# Altium schematic sheet Supply_BuckVout.SchDoc: Power Supply
size 420 x 297 mm; EDA_Number: ARTIQ; Projet: HVPSU_ISOL; Author: G.Kasprowicz; CompanyName: WUT ISE; DrawnBy: G.Kasprowicz; Organization: WUT ISE; Address1: PW ISE; Address2: Nowowiejska 15/19 00-665 Warsaw; Address3: gkasprow@gmail.com; DocumentNumber: 4; Revision: 2; SheetNumber: 4; SheetTotal: 7; ModifiedBy: -; CheckedDate: -; DivGrp: WUT ISE; Designer: G.Kasprowicz; ModifiedDate: -; ProjectName: Sensor Box
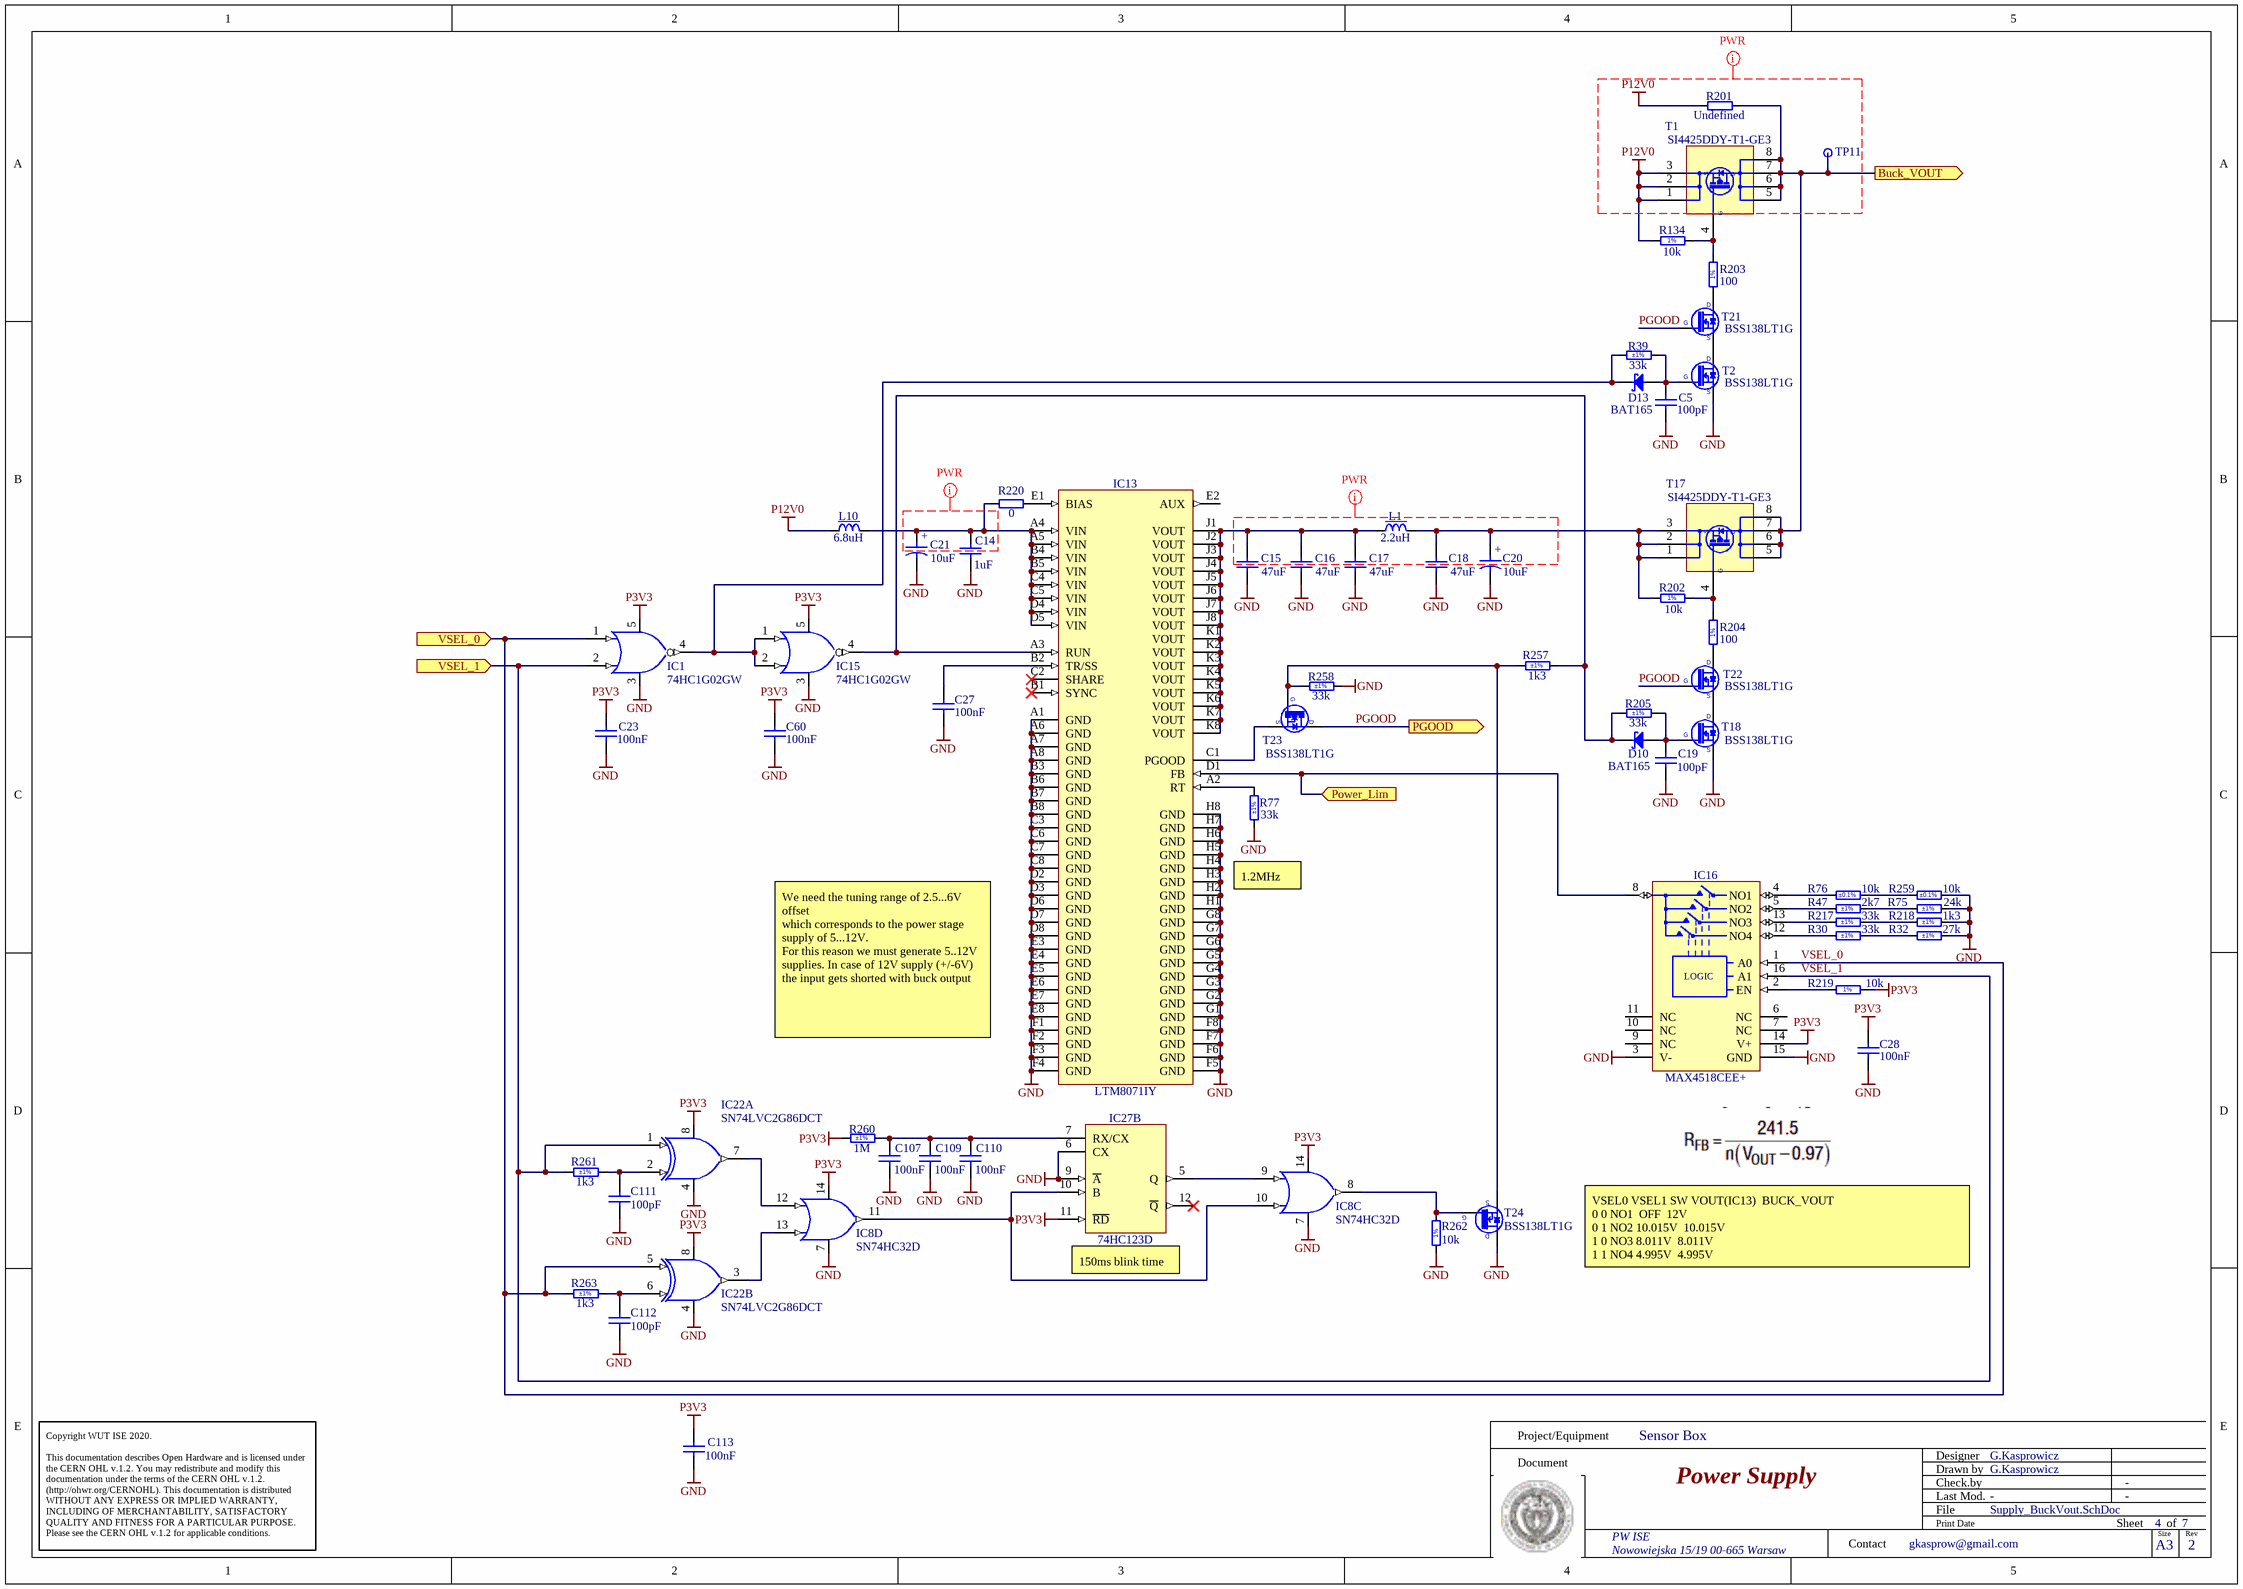
[diagram p0: Supply_BuckVout.SchDoc]

## Parts
C5  100pF  [CAPC1608X90N]
C14  1uF  [CAPC1608X87N]
C15  47uF  [CAPC3216X180N]
C16  47uF  [CAPC3216X180N]
C17  47uF  [CAPC3216X180N]
C18  47uF  [CAPC3216X180N]
C19  100pF  [CAPC1608X90N]
C20  10uF  [CAPMP3216X180N]
C21  10uF  [CAPMP3216X180N]
C23  100nF  [CAPC1005X55N]
C27  100nF  [CAPC1005X55N]
C28  100nF  [CAPC1005X55N]
C60  100nF  [CAPC1005X55N]
C107  100nF  [CAPC1005X55N]
C109  100nF  [CAPC1005X55N]
C110  100nF  [CAPC1005X55N]
C111  100pF  [CAPC1608X90N]
C112  100pF  [CAPC1608X90N]
C113  100nF  [CAPC1005X55N]
D10  BAT165  [SOD2512X110N]
D13  BAT165  [SOD2512X110N]
IC1  74HC1G02GW  [SOT65P212X110-5N]
IC8  SN74HC32D  [SOIC127P600X175-14N]  (parts C,D of 4)
IC13  LTM8071IY  [BGA80C100P8X10_900X1125X352]
IC15  74HC1G02GW  [SOT65P212X110-5N]
IC16  MAX4518CEE+  [SOP63P600X175-16N]
IC22  SN74LVC2G86DCT  [SOP65P400X130-8N]  (parts A,B of 2)
IC27  74HC123D  [SOIC127P600X175-16N]  (part B of 2)
L1  2.2uH  [IND_COILCRAFT_XFL4020]
L10  6.8uH  [IND_COILCRAFT_XAL4030]
R30  33k  Tolerance: ±1%  [RESC1608X55N]
R32  27k  Tolerance: ±1%  [RESC1608X55N]
R39  33k  Tolerance: ±1%  [RESC1608X55N]
R47  2k7  Tolerance: ±1%  [RESC1608X55N]
R75  24k  Tolerance: ±1%  [RESC1608X55N]
R76  10k  Tolerance: ±0.1%  [RESC1608X55N]
R77  33k  Tolerance: ±1%  [RESC1608X55N]
R134  10k  [RESC1005X40N]
R201  Undefined  [RESC3216X65N]
R202  10k  [RESC1005X40N]
R203  100  [RESC1005X40N]
R204  100  [RESC1005X40N]
R205  33k  Tolerance: ±1%  [RESC1608X55N]
R217  33k  Tolerance: ±1%  [RESC1608X55N]
R218  1k3  Tolerance: ±1%  [RESC1608X55N]
R219  10k  [RESC1005X40N]
R220  0  [RESC1005X40N]
R257  1k3  Tolerance: ±1%  [RESC1608X55N]
R258  33k  Tolerance: ±1%  [RESC1608X55N]
R259  10k  Tolerance: ±0.1%  [RESC1608X55N]
R260  1M  Tolerance: ±1%  [RESC1608X55N]
R261  1k3  Tolerance: ±1%  [RESC1608X55N]
R262  10k  [RESC1005X40N]
R263  1k3  Tolerance: ±1%  [RESC1608X55N]
T1  SI4425DDY-T1-GE3  [SOIC127P600X175-8N]
T2  BSS138LT1G  [SOT95P240X110-3N]
T17  SI4425DDY-T1-GE3  [SOIC127P600X175-8N]
T18  BSS138LT1G  [SOT95P240X110-3N]
T21  BSS138LT1G  [SOT95P240X110-3N]
T22  BSS138LT1G  [SOT95P240X110-3N]
T23  BSS138LT1G  [SOT95P240X110-3N]
T24  BSS138LT1G  [SOT95P240X110-3N]
TP11  Test Point  [TPS127]  (value not drawn)  (no BOM)

## Ports
Buck_VOUT (out), PGOOD (out), Power_Lim (in), VSEL_0 (in), VSEL_1 (in)

## Nets
GND: C5.1 C14.1 C15.1 C16.1 C17.1 C18.1 C19.1 C20.2 C21.2 C23.1 C27.1 C28.1 C60.1 C107.1 C109.1 C110.1 C111.1 C112.1 C113.1 IC1.3(GND) IC8.7(GND) IC13.A1(GND) IC13.A6(GND) IC13.A7(GND) IC13.A8(GND) IC13.B3(GND) IC13.B6(GND) IC13.B7(GND) IC13.B8(GND) IC13.C3(GND) IC13.C6(GND) IC13.C7(GND) IC13.C8(GND) IC13.D2(GND) IC13.D3(GND) IC13.D6(GND) IC13.D7(GND) IC13.D8(GND) IC13.E3(GND) IC13.E4(GND) IC13.E5(GND) IC13.E6(GND) IC13.E7(GND) IC13.E8(GND) IC13.F1(GND) IC13.F2(GND) IC13.F3(GND) IC13.F4(GND) IC13.F5(GND) IC13.F6(GND) IC13.F7(GND) IC13.F8(GND) IC13.G1(GND) IC13.G2(GND) IC13.G3(GND) IC13.G4(GND) IC13.G5(GND) IC13.G6(GND) IC13.G7(GND) IC13.G8(GND) IC13.H1(GND) IC13.H2(GND) IC13.H3(GND) IC13.H4(GND) IC13.H5(GND) IC13.H6(GND) IC13.H7(GND) IC13.H8(GND) IC15.3(GND) IC16.3(V-) IC16.15(GND) IC22.4(GND) IC27.6(CX) IC27.9(~{A}) R32.2 R75.2 R77.1 R218.2 R258.2 R259.2 R262.1 T2.2(S) T18.2(S) T24.3(D)
P3V3: C23.2 C28.2 C60.2 C113.2 IC1.5(VCC) IC8.14(VCC) IC15.5(VCC) IC16.14(V+) IC22.8(VCC) IC27.11(~{RD}) R219.2 R260.1
P12V0: L10.1 R134.1 R201.1 T1.1(S) T1.2(S) T1.3(S)
Buck_VOUT: R201.2 T1.5(D) T1.6(D) T1.7(D) T1.8(D) T17.5(D) T17.6(D) T17.7(D) T17.8(D) TP11.1 ; port Buck_VOUT
PGOOD: T21.1(G) T22.1(G) T23.3(D) ; port PGOOD
Power_Lim: IC13.D1(FB) IC16.8(COM) ; port Power_Lim
VSEL_0: IC1.1(B) IC16.1(A0) IC22.5(A) R263.1 ; port VSEL_0
VSEL_1: IC1.2(A) IC16.16(A1) IC22.1(A) R261.1 ; port VSEL_1
NetC5_2: C5.2 D13.2(A) R39.2 T2.1(G)
NetC14_2: C14.2 C21.1 IC13.A4(VIN) IC13.A5(VIN) IC13.B4(VIN) IC13.B5(VIN) IC13.C4(VIN) IC13.C5(VIN) IC13.D4(VIN) IC13.D5(VIN) L10.2 R220.2
NetC15_2: C15.2 C16.2 C17.2 IC13.J1(VOUT) IC13.J2(VOUT) IC13.J3(VOUT) IC13.J4(VOUT) IC13.J5(VOUT) IC13.J6(VOUT) IC13.J7(VOUT) IC13.J8(VOUT) IC13.K1(VOUT) IC13.K2(VOUT) IC13.K3(VOUT) IC13.K4(VOUT) IC13.K5(VOUT) IC13.K6(VOUT) IC13.K7(VOUT) IC13.K8(VOUT) L1.1
NetC18_2: C18.2 C20.1 L1.2 R202.1 T17.1(S) T17.2(S) T17.3(S)
NetC19_2: C19.2 D10.2(A) R205.2 T18.1(G)
NetC27_2: C27.2 IC13.B2(TR/SS)
NetC107_2: C107.2 C109.2 C110.2 IC27.7(RX/CX) R260.2
NetC111_2: C111.2 IC22.2(B) R261.2
NetC112_2: C112.2 IC22.6(B) R263.2
NetD10_1: D10.1(C) IC13.A3(RUN) IC15.4(Y) R205.1 R257.2
NetD13_1: D13.1(C) IC1.4(Y) IC15.1(B) IC15.2(A) R39.1
NetIC8_8: IC8.8(Y) R262.2 T24.1(G)
NetIC8_9: IC8.9(A) IC27.5(Q)
NetIC8_10: IC8.10(B) IC8.11(Y) IC27.10(B)
NetIC8_12: IC8.12(A) IC22.7(Y)
NetIC8_13: IC8.13(B) IC22.3(Y)
NetIC13_A2: IC13.A2(RT) R77.2
NetIC13_C1: IC13.C1(PGOOD) T23.2(S)
NetIC13_E1: IC13.E1(BIAS) R220.1
NetIC16_2: IC16.2(EN) R219.1
NetIC16_4: IC16.4(NO1) R76.1
NetIC16_5: IC16.5(NO2) R47.1
NetIC16_12: IC16.12(NO4) R30.1
NetIC16_13: IC16.13(NO3) R217.1
NetR30_2: R30.2 R32.1
NetR47_2: R47.2 R75.1
NetR76_2: R76.2 R259.1
NetR134_2: R134.2 R203.2 T1.4(S)
NetR202_2: R202.2 R204.2 T17.4(S)
NetR203_1: R203.1 T21.3(D)
NetR204_1: R204.1 T22.3(D)
NetR217_2: R217.2 R218.1
NetR257_1: R257.1 R258.1 T23.1(G) T24.2(S)
NetT2_3: T2.3(D) T21.2(S)
NetT18_3: T18.3(D) T22.2(S)

Not connected (* = marked no-connect by the designer): IC13 B1(SYNC)* C2(SHARE)* E2(AUX); IC16 6(NC) 7(NC) 9(NC) 10(NC) 11(NC); IC27 12(~{Q})*

## Layout directives
net class PWR: (no net found under the mark), P12V0

## Notes on the sheet
- 1.2MHz
- We need the tuning range of 2.5...6V offset
  which corresponds to the power stage supply of 5...12V.
  For this reason we must generate 5..12V supplies. In case of 12V supply (+/-6V) the input gets shorted with buck output
- (near IC27) 150ms blink time
- VSEL0	VSEL1	SW	VOUT(IC13) 	BUCK_VOUT
  0	0	NO1 	OFF		12V
  0	1	NO2	10.015V		10.015V
  1	0	NO3	8.011V		8.011V
  1	1	NO4	4.995V		4.995V
- Project/Equipment
- Document
- Designer
- Drawn by
- Check.by
- Copyright WUT ISE 2020.
  This documentation describes Open Hardware and is licensed under the CERN OHL v.1.2. You may redistribute and modify this documentation under the terms of the CERN OHL v.1.2. (http://ohwr.org/CERNOHL). This documentation is distributed WITHOUT ANY EXPRESS OR IMPLIED WARRANTY, INCLUDING OF MERCHANTABILITY, SATISFACTORY QUALITY AND FITNESS FOR A PARTICULAR PURPOSE. Please see the CERN OHL v.1.2 for applicable conditions.
- Contact
- File
- Last Mod.
- Print Date
- Sheet
- Size
- A3
- of
- Rev
- (in symbol CTE3216-18_10UF_16V_20%_AVX_TCJ) +
- (in symbol MAX4518CEE+) LOGIC
- (in symbol R0402_10K_1%_0.0625W_100PPM) 1%
- (in symbol R0402_100R_1%_0.0625W_100PPM) 1%
- (in symbol SI4425DDY-T1-GE3) G

## Library data of the parts
C5 C19 C111 C112 = CC0603_100PF_50V_1%_NP0: Non-polarised capacitor; Part Description: SMD Multilayer Chip Ceramic Capacitor; Manufacturer: GENERIC; Manufacturer1 Part Number: 06035A101FAT2A; Voltage: 50V; TC: C0G/NP0; Tolerance: ±1%; Part Number: CC0603_100PF_50V_1%_NP0; Component Kind: Standard; Component Type: Standard; Pin Count: 2; Value: 100pF; Status: None; Manufacturer Part Number: CC0603_100PF_50V_1%_NP0; Case: 0603; Mounted: Yes; Socket: No; SMD: Yes; Sense: No; Manufacturer1 Example: AVX; Manufacturer1 ComponentHeight: 0.9mm; HelpURL: \\cern.ch\dfs\Applications\Altium\Datasheets\CC0603_C0G_AVX.pdf; Author: CERN DEM JLC; CreateDate: 15.06.2017; LatestRevisionDate: 15.06.2017
C14 = CC0603_1UF_25V_10%_X7R: Non-polarised capacitor; Part Description: SMD Multilayer Chip Ceramic Capacitor; Manufacturer: GENERIC; Manufacturer1 Part Number: GCM188R71E105KA64D; Voltage: 25V; TC: X7R; Tolerance: ±10%; Part Number: CC0603_1UF_25V_10%_X7R; Component Kind: Standard; Component Type: Standard; Pin Count: 2; Value: 1uF; Status: None; Manufacturer Part Number: CC0603_1UF_25V_10%_X7R; Case: 0603; Mounted: Yes; Socket: No; SMD: Yes; Sense: No; Manufacturer1 Example: MURATA; Manufacturer1 ComponentHeight: 0.9mm; HelpURL: \\cern.ch\dfs\Applications\Altium\Datasheets\CC0603_X7R_MURATA.pdf; Author: CERN DEM JLC; CreateDate: 18.01.2011; LatestRevisionDate: 18.01.2011
C15-C18 = CC1206_47UF_25V_20%_X5R: Non-polarised capacitor; Part Description: SMD Multilayer Chip Ceramic Capacitor; Manufacturer: GENERIC; Manufacturer1 Part Number: C3216X5R1E476M160; Voltage: 25V; TC: X5R; Tolerance: ±20%; Part Number: CC1206_47UF_25V_20%_X5R; Component Kind: Standard; Component Type: Standard; Pin Count: 2; Value: 47uF; Status: None; Manufacturer Part Number: CC1206_47UF_25V_20%_X5R; Case: 1206; Mounted: Yes; Socket: No; SMD: Yes; Sense: No; Manufacturer1 Example: TDK; Manufacturer1 ComponentHeight: 1.8mm; HelpURL: \\cern.ch\dfs\Applications\Altium\Datasheets\CC1206_X5R_TDK_C.pdf; Author: CERN DEM JLC; CreateDate: 20.11.2013; LatestRevisionDate: 14.03.2017
C20 C21 = CTE3216-18_10UF_16V_20%_AVX_TCJ: Polarised capacitor; Part Description: ESR 0R200 Tantalum Solid Electrolytic Chip Capacitor with Conductive Polymer Electrode; Manufacturer: AVX; Manufacturer Part Number: TCJA106M016R0200 or  or TR3A106K016C1700; Manufacturer1 Part Number: TCJA106M016R0200; Voltage: 16V; Tolerance: ±20%; Part Number: CTE3216-18_10UF_16V_20%_AVX_TCJ; Component Kind: Standard; Component Type: Standard; Pin Count: 2; Value: 10uF; Status: Preferred; Case: A; Mounted: Yes; Socket: No; SMD: Yes; Sense: No; ComponentHeight: 1.8mm; HelpURL: \\cern.ch\dfs\Applications\Altium\Datasheets\CTE_AVX_TCJ.pdf; Author: CERN DEM JLC; CreateDate: 29.03.2012; LatestRevisionDate: 29.03.2012
C23 C27 C28 C60 C107 C109 C110 C113 = CC0402_100NF_16V_10%_X5R: Non-polarised capacitor; Part Description: SMD Multilayer Chip Ceramic Capacitor; Manufacturer: GENERIC; Manufacturer1 Part Number: GRM155R61C104KA88D; Voltage: 16V; TC: X5R; Tolerance: ±10%; Part Number: CC0402_100NF_16V_10%_X5R; Component Kind: Standard; Component Type: Standard; Pin Count: 2; Value: 100nF; Status: None; Manufacturer Part Number: CC0402_100NF_16V_10%_X5R; Case: 0402; Mounted: Yes; Socket: No; SMD: Yes; Sense: No; Manufacturer1 Example: MURATA; Manufacturer1 ComponentHeight: 0.55mm; HelpURL: \\cern.ch\dfs\Applications\Altium\Datasheets\CC0402_X5R_MURATA_GRM.pdf; Author: CERN DEM JLC; CreateDate: 10.12.2013; LatestRevisionDate: 10.12.2013
D10 D13 = BAT165: Schottky Diode; Manufacturer: INFINEON; Part Description: Medium Power AF Schottky Diode; Manufacturer1 Part Number: BAT 165 E6327; Voltage: 40V; Power: 750mA; PressFit: No; Bonding: No; Manufacturer Part Number: BAT165; PackageDescription: Small Outline Diode (SOD-323), 1.70mm W X 1.25mm L X 1.10mm H body,  IPC Medium Density; Part Number: BAT165; Component Kind: Standard; Component Type: Standard; Device: BAT165; Pin Count: 2; Case: SOD323; Mounted: Yes; Socket: No; SMD: Yes; Sense: No; ComponentHeight: 1.1mm; HelpURL: \\cern.ch\dfs\Applications\Altium\Datasheets\BAT165.pdf; Author: CERN DEM JLC; CreateDate: 12.11.2014; LatestRevisionDate: 12.11.2014
IC1 IC15 = 74HC1G02GW: Single 2-Input NOR Gate; Manufacturer1: NEXPERIA; Manufacturer1 Part Number: 74HC1G02GW-Q100,12; PressFit: No; Bonding: No; Part Number: 74HC1G02GW; Component Kind: Standard; Component Type: Standard; Device: 74HC1G02GW; PackageDescription: SOT353, SOT, 0.65mm Pitch, 5 pin, 1.25mm W X 2.05mm L X 1.10mm H, IPC Medium Density; Part Description: Single 2-Input NOR Gate; Pin Count: 5; Case: SOT353; Mounted: Yes; Socket: No; SMD: Yes; Sense: No; ComponentHeight: 1.1mm; Author: CERN DEM MR; HelpURL: \\cern.ch\dfs\Applications\Altium\Datasheets\74HC1G02GW.pdf; CreateDate: 12/12/2017; LatestRevisionDate: 12/03/2019
IC8 = SN74HC32D: Quad 2-Input OR Gate; Part Description: Quadruple 2-Input Positive-OR Gate; Manufacturer1: TEXAS INSTRUMENTS; PressFit: No; Bonding: No; Part Number: SN74HC32D; Component Kind: Standard; Component Type: Standard; Device: SN74HC32D; PackageDescription: SOIC 14, Pitch 1.27mm - Body 4x8.75mm, IPC Medium Density; Manufacturer1 Part Number: SN74HC32D; Pin Count: 14; Case: SOIC14; Mounted: Yes; Socket: No; SMD: Yes; Sense: No; ComponentHeight: 1.75mm; Author: CERN DEM JLC; HelpURL: \\cern.ch\dfs\Applications\Altium\Datasheets\SN74HC32D.pdf; CreateDate: 18/03/2014; LatestRevisionDate: 18/03/2014
IC13 = LTM8071IY#PBF: 60V, 5A Silent Switcher uModule Regulator; Manufacturer1: ANALOG DEVICES; PressFit: No; Bonding: No; Part Number: LTM8071IY#PBF; Component Kind: Standard; Component Type: Standard; Device: LTM8071IY; PackageDescription: BGA, 1.00mm Pitch, Rect.; 80 Pin, 8 Columns X 10 Rows, 9.00mm X 11.25mm X 3.52mm H body, IPC Medium Density; Part Description: 60V, 5A Silent Switcher uModule Regulator; Manufacturer1 Part Number: LTM8071IY; Pin Count: 80; Case: BGA80; Mounted: Yes; Socket: No; SMD: Yes; Sense: No; ComponentHeight: 3.52mm; HelpURL: \\cern.ch\dfs\Applications\Altium\Datasheets\LTM8071IY#PBF.pdf; Author: CERN DEM BC; CreateDate: 09.03.2020; LatestRevisionDate: 03.02.2022
IC16 = MAX4518CEE+: Precision, 4-Channel Low-Voltage, CMOS Analog Multiplexer; Manufacturer1: MAXIM; PressFit: No; Bonding: No; Part Number: MAX4518CEE+; Component Kind: Standard; Component Type: Standard; Device: MAX4518CEE+; PackageDescription: SOP, 0.635mm Pitch; 16 Pin, 3.9mm W X 4.895mm L X 1.75mm H body, IPC Medium Density; Part Description: Precision, 4-Channel Low-Voltage, CMOS Analog Multiplexer; Manufacturer1 Part Number: MAX4518CEE+; Pin Count: 16; Case: SSOP16; Mounted: Yes; Socket: No; SMD: Yes; Sense: No; ComponentHeight: 1.75mm; Author: CERN DEM JLC; HelpURL: \\cern.ch\dfs\Applications\Altium\Datasheets\MAX4518CEE+.pdf; CreateDate: 10.11.2014; LatestRevisionDate: 04.04.2022
IC22 = SN74LVC2G86DCT: Dual 2-Input Exclusive-OR Gate; Manufacturer1: TEXAS INSTRUMENTS; Manufacturer1 Part Number: SN74LVC2G86DCTR; PressFit: No; Bonding: No; Part Number: SN74LVC2G86DCT; Component Kind: Standard; Component Type: Standard; Device: SN74LVC2G86DCT; PackageDescription: SOP, 0.65mm, Pitch; 8 Pin, 2.80mm W X 2.95mm L X 1.30mm H Body, PC Medium Density; Part Description: Dual 2-Input Exclusive-OR Gate; Pin Count: 8; Case: TSSOP8; Mounted: Yes; Socket: No; SMD: Yes; Sense: No; ComponentHeight: 1.3mm; Author: CERN DEM MR; HelpURL: \\cern.ch\dfs\Applications\Altium\Datasheets\SN74LVC2G86DCT.pdf; CreateDate: 04/07/2016; LatestRevisionDate: 04/07/2016
IC27 = 74HC123D: Retriggerable Monostable Multivibrator; Part Description: Dual Retriggerable Monostable Multivibrator with Reset; Manufacturer1: NEXPERIA; PressFit: No; Bonding: No; Part Number: 74HC123D; Component Kind: Standard; Component Type: Standard; Device: 74HC123D; PackageDescription: SOIC 16, Pitch 1.27mm - Body 4x10mm, IPC Medium Density; Manufacturer1 Part Number: 74HC123D; Pin Count: 16; Case: SOIC16; Mounted: Yes; Socket: No; SMD: Yes; Sense: No; ComponentHeight: 1.75mm; Author: CERN DEM BC; HelpURL: \\cern.ch\dfs\Applications\Altium\Datasheets\74HC123D.pdf; CreateDate: 21.04.2020; LatestRevisionDate: 21.04.2020
L1 = IND_2.2UH_20%_COILCRAFT_XFL4020-222ME: Inductor With Core; Part Description: SMD Shielded Power Inductor; Manufacturer1 Part Number: XFL4020-222MEC; Power: 5.2A; Resistance: 0.00235R; Tolerance: ±20%; Part Number: IND_2.2UH_20%_COILCRAFT_XFL4020-222ME; Component Kind: Standard; Component Type: Standard; Pin Count: 2; Value: 2.2uH; Manufacturer1: COILCRAFT; Mounted: Yes; Socket: No; SMD: Yes; Sense: No; ComponentHeight: 2.1mm; HelpURL: \\cern.ch\dfs\Applications\Altium\Datasheets\IND_COILCRAFT_XFL4020.pdf; Author: CERN DEM HF; CreateDate: 23.10.2023; LatestRevisionDate: 23.10.2023
L10 = IND_6.8UH_20%_COILCRAFT_XAL4030: Inductor With Core; Part Description: SMD Shielded Power Inductor; Manufacturer1 Part Number: XAL4030-682MEC; Power: 3A; Resistance: 0.0741R; Tolerance: ±20%; Part Number: IND_6.8UH_20%_COILCRAFT_XAL4030; Component Kind: Standard; Component Type: Standard; Pin Count: 2; Value: 6.8uH; Status: None; Manufacturer1: COILCRAFT; Mounted: Yes; Socket: No; SMD: Yes; Sense: No; ComponentHeight: 2.1mm; HelpURL: \\cern.ch\dfs\Applications\Altium\Datasheets\IND_COILCRAFT_XAL4030.pdf; Author: CERN DEM MR; CreateDate: 14.03.2016; LatestRevisionDate: 14.03.2016
R30 R39 R77 R205 R217 R258 = R0603_33K_1%_0.1W_100PPM: Resistor - 1%; Part Description: General Purpose Thick Film Chip Resistor; Manufacturer: GENERIC; Manufacturer1: Vishay; Manufacturer1 Part Number: CRCW06033K30FKEBC; Power: 0.1W; TC: ±100ppm/°C; PressFit: No; Part Number: R0603_33K_1%_0.1W_100PPM; Component Kind: Standard; Component Type: Standard; Pin Count: 2; Value: 33k; Status: Preferred; Manufacturer Part Number: R0603_33K_1%_0.1W_100PPM; Case: 0603; Mounted: Yes; Sense: No; Socket: No; SMD: Yes; Manufacturer1 ComponentHeight: 0.55mm; HelpURL: \\cern.ch\dfs\Applications\Altium\Datasheets\R0603_NIC_NRC.pdf; Author: CERN DEM JLC; CreateDate: 03.12.2007; LatestRevisionDate: 13.03.2008
R32 = R0603_27K_1%_0.1W_100PPM: Resistor - 1%; Part Description: General Purpose Thick Film Chip Resistor; Manufacturer: GENERIC; Manufacturer1: Vishay; Manufacturer1 Part Number: CRCW060327K0FKEA; Power: 0.1W; TC: ±100ppm/°C; PressFit: No; Part Number: R0603_27K_1%_0.1W_100PPM; Component Kind: Standard; Component Type: Standard; Pin Count: 2; Value: 27k; Status: Preferred; Manufacturer Part Number: R0603_27K_1%_0.1W_100PPM; Case: 0603; Mounted: Yes; Sense: No; Socket: No; SMD: Yes; Manufacturer1 ComponentHeight: 0.55mm; HelpURL: \\cern.ch\dfs\Applications\Altium\Datasheets\R0603_NIC_NRC.pdf; Author: CERN DEM JLC; CreateDate: 03.12.2007; LatestRevisionDate: 13.03.2008
R47 = R0603_2K7_1%_0.1W_100PPM: Resistor - 1%; Part Description: General Purpose Thick Film Chip Resistor; Manufacturer: GENERIC; Manufacturer1: YAGEO PHYCOMP; Manufacturer1 Part Number: RC0603FR-072K7L; Power: 0.1W; TC: ±100ppm/°C; PressFit: No; Part Number: R0603_2K7_1%_0.1W_100PPM; Component Kind: Standard; Component Type: Standard; Pin Count: 2; Value: 2k7; Status: Preferred; Manufacturer Part Number: R0603_2K7_1%_0.1W_100PPM; Case: 0603; Mounted: Yes; Sense: No; Socket: No; SMD: Yes; Manufacturer1 ComponentHeight: 0.55mm; HelpURL: \\cern.ch\dfs\Applications\Altium\Datasheets\R0603_PHYCOMP_RC0603.pdf; Author: CERN DEM JLC; CreateDate: 02.05.2011; LatestRevisionDate: 02.05.2011
R75 = R0603_24K_1%_0.1W_100PPM: Resistor - 1%; Part Description: General Purpose Thick Film Chip Resistor; Manufacturer: GENERIC; Manufacturer1: Vishay; Manufacturer1 Part Number: CRCW060324K0FKEA; Power: 0.1W; TC: ±100ppm/°C; PressFit: No; Part Number: R0603_24K_1%_0.1W_100PPM; Component Kind: Standard; Component Type: Standard; Pin Count: 2; Value: 24k; Status: Preferred; Manufacturer Part Number: R0603_24K_1%_0.1W_100PPM; Case: 0603; Mounted: Yes; Sense: No; Socket: No; SMD: Yes; Manufacturer1 ComponentHeight: 0.55mm; HelpURL: \\cern.ch\dfs\Applications\Altium\Datasheets\R0603_NIC_NRC.pdf; Author: CERN DEM JLC; CreateDate: 03.12.2007; LatestRevisionDate: 13.03.2008
R76 R259 = R0603_10K_0.1%_0.063W_10PPM: Resistor - 0.1%; Part Description: Thin Film Chip Resistor; Manufacturer: GENERIC; Manufacturer1 Part Number: RN73C1J10KBTDF; Power: 0.063W; TC: ±10ppm; PressFit: No; Part Number: R0603_10K_0.1%_0.063W_10PPM; Component Kind: Standard; Component Type: Standard; Pin Count: 2; Value: 10k; Status: Not Recommended; Manufacturer Part Number: R0603_10K_0.1%_0.063W_10PPM; Case: 0603; Mounted: Yes; Sense: No; Socket: No; SMD: Yes; Manufacturer1 Example: TYCO HOLSWORTHY; Manufacturer1 ComponentHeight: 0.5mm; HelpURL: \\cern.ch\dfs\Applications\Altium\Datasheets\R0603_Tyco_RN73.pdf; Author: CERN DEM JLC; CreateDate: 03.12.2007; LatestRevisionDate: 13.03.2008
R134 R202 R219 R262 = R0402_10K_1%_0.0625W_100PPM: Resistor - 1%; Part Description: General Purpose Thick Film Chip Resistor; Manufacturer: GENERIC; Manufacturer1: Vishay; Manufacturer1 Part Number: RCA040210K0FKED; TC: ±100ppm/°C; Part Number: R0402_10K_1%_0.0625W_100PPM; Component Kind: Standard; Component Type: Standard; Pin Count: 2; Value: 10k; Status: Not recommended; Power: 0.0625W; Tolerance: ±1%; Manufacturer Part Number: R0402_10K_1%_0.0625W_100PPM; Case: 0402; Mounted: Yes; Sense: No; Socket: No; SMD: Yes; Manufacturer1 ComponentHeight: 0.4mm; HelpURL: \\cern.ch\dfs\Applications\Altium\Datasheets\R0402_Phycomp_RC0402.pdf; Author: CERN DEM JLC; CreateDate: 2007-12-03; LatestRevisionDate: 2012-10-17
R201 = R1206_NO-VALUE: Resistor; Part Description: Reserved Footprint For a 1206 (3216) Chip Resistor; PressFit: No; Mounted: No; Part Number: R1206_NO-VALUE; Component Kind: Standard; Component Type: Standard; Pin Count: 2; Value: Undefined; Status: None; Manufacturer: Undefined; Manufacturer Part Number: R1206_NO-VALUE; Case: 1206; Sense: No; Socket: No; SMD: Yes; Manufacturer1 Example: Undefined; Manufacturer1 Part Number: Undefined; Manufacturer1 ComponentHeight: Undefined; HelpURL: Undefined; Author: CERN DEM JLC; CreateDate: 03.12.2007; LatestRevisionDate: 13.03.2008
R203 R204 = R0402_100R_1%_0.0625W_100PPM: Resistor - 1%; Part Description: General Purpose Thick Film Chip Resistor; Manufacturer: GENERIC; Manufacturer1: Vishay; Manufacturer1 Part Number: RCA0402100RFKED; TC: ±100ppm/°C; PressFit: No; Part Number: R0402_100R_1%_0.0625W_100PPM; Component Kind: Standard; Component Type: Standard; Pin Count: 2; Value: 100; Status: Not Recommended; Power: 0.0625W; Tolerance: ±1%; Manufacturer Part Number: R0402_100R_1%_0.0625W_100PPM; Case: 0402; Mounted: Yes; Sense: No; Socket: No; SMD: Yes; Manufacturer1 ComponentHeight: 0.4mm; HelpURL: \\cern.ch\dfs\Applications\Altium\Datasheets\R0402_Phycomp_RC0402.pdf; Author: CERN DEM JLC; CreateDate: 03.12.2007; LatestRevisionDate: 17.10.2012
R218 R257 R261 R263 = R0603_1K3_1%_0.1W_100PPM: Resistor - 1%; Part Description: General Purpose Thick Film Chip Resistor; Manufacturer: GENERIC; Manufacturer1: Vishay; Manufacturer1 Part Number: CRCW06031K30FKEAC; Power: 0.1W; TC: ±100ppm/°C; PressFit: No; Part Number: R0603_1K3_1%_0.1W_100PPM; Component Kind: Standard; Component Type: Standard; Pin Count: 2; Value: 1k3; Status: Preferred; Manufacturer Part Number: R0603_1K3_1%_0.1W_100PPM; Case: 0603; Mounted: Yes; Sense: No; Socket: No; SMD: Yes; Manufacturer1 ComponentHeight: 0.55mm; HelpURL: \\cern.ch\dfs\Applications\Altium\Datasheets\R0603_NIC_NRC.pdf; Author: CERN DEM JLC; CreateDate: 03.12.2007; LatestRevisionDate: 13.03.2008
R220 = R0402_0R_JUMPER: Resistor; Part Description: 1A (0.05R Max DC Resistance) Zero Ohm Jumper; Manufacturer: GENERIC; Manufacturer1: Vishay; Manufacturer1 Part Number: CRCW04020000Z0EDC; Part Number: R0402_0R_JUMPER; Component Kind: Standard; Component Type: Standard; Pin Count: 2; Value: 0; Status: Not recommended; Manufacturer Part Number: R0402_0R_JUMPER; Case: 0402; Mounted: Yes; Sense: No; Socket: No; SMD: Yes; Manufacturer1 ComponentHeight: 0.4mm; HelpURL: \\cern.ch\dfs\Applications\Altium\Datasheets\R0402_Phycomp_RC0402.pdf; Author: CERN DEM JLC; CreateDate: 03.12.2007; LatestRevisionDate: 17.10.2012
R260 = R0603_1M_1%_0.1W_100PPM: Resistor - 1%; Part Description: General Purpose Thick Film Chip Resistor; Manufacturer: GENERIC; Manufacturer1: Vishay; Manufacturer1 Part Number: CRCW06031M00FKEA; Power: 0.1W; TC: ±100ppm/°C; PressFit: No; Part Number: R0603_1M_1%_0.1W_100PPM; Component Kind: Standard; Component Type: Standard; Pin Count: 2; Value: 1M; Status: Preferred; Manufacturer Part Number: R0603_1M_1%_0.1W_100PPM; Case: 0603; Mounted: Yes; Sense: No; Socket: No; SMD: Yes; Manufacturer1 ComponentHeight: 0.55mm; HelpURL: \\cern.ch\dfs\Applications\Altium\Datasheets\R0603_NIC_NRC.pdf; Author: CERN DEM JLC; CreateDate: 03.12.2007; LatestRevisionDate: 13.03.2008
T1 T17 = SI4425DDY-T1-GE3: -30V -19.7A P-Channel MOSFET; Manufacturer1: VISHAY SILICONIX; PressFit: No; Bonding: No; Part Number: SI4425DDY-T1-GE3; Component Kind: Standard; Component Type: Standard; Device: SI4425DDY-T1-GE3; PackageDescription: SOIC 8, Pitch 1.27mm - Body 4x5mm, IPC Medium Density; Part Description: -30V -19.7A P-Channel MOSFET; Manufacturer1 Part Number: SI4425DDY-T1-GE3; Pin Count: 8; Case: SOIC8; Mounted: Yes; Socket: No; SMD: Yes; Sense: No; ComponentHeight: 1.75mm; HelpURL: \\cern.ch\dfs\Applications\Altium\Datasheets\SI4425DDY-T1-GE3.pdf; Author: CERN DEM MR; CreateDate: 05/10/2016; LatestRevisionDate: 05/10/2016
T2 T18 T21-T24 = BSS138LT1G: N-CHANNEL MOSFET WITH DIODE; Part Description: 50V 200mA N-Channel Enhancement Mode Field-Effect Transistor; Manufacturer1: ON SEMICONDUCTOR; PressFit: No; Bonding: No; Part Number: BSS138LT1G; Component Kind: Standard; Component Type: Standard; Device: BSS138LT1G; PackageDescription: SOT23 3-Leads, Pitch 0.95mm - Body 1.4x3mm, IPC Medium Density; Manufacturer1 Part Number: BSS138LT1G; Pin Count: 3; Case: SOT23-3; Mounted: Yes; Socket: No; SMD: Yes; Sense: No; ComponentHeight: 1.11mm; HelpURL: \\cern.ch\dfs\Applications\Altium\Datasheets\BSS138LT1G.pdf; Author: CERN DEM JLC; CreateDate: 23.03.2009; LatestRevisionDate: 23.03.2009
TP11 = SMD_PAD_1.27X1.27MM: Part Description: 1.27mm x 1.27mm PCB Copper Area (SMD Test Point); Mounted: No; Part Number: SMD_PAD_1.27X1.27MM; Component Type: Standard (No BOM); Pin Count: 1; Family: Test Point; Socket: No; SMD: Yes; Sense: No; Status: None; ComponentHeight: 0mm; HelpURL: Undefined; Author: CERN DEM JLC; CreateDate: 12.01.2008; LatestRevisionDate: 12.01.2008; PackageDescription: 1.27mm x 1.27mm PCB Copper Area (SMD Test Point)